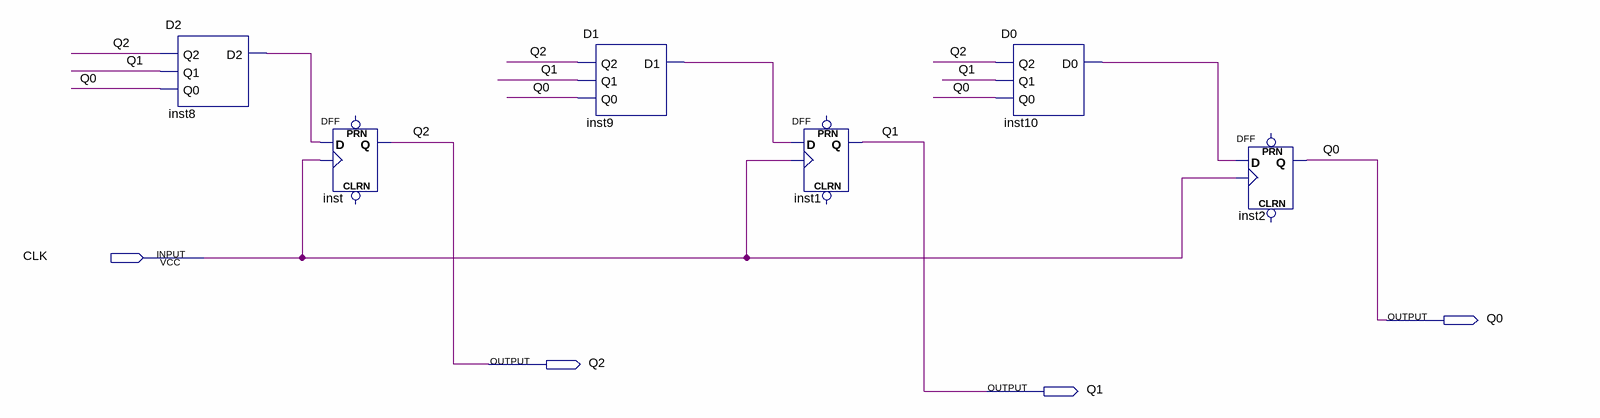
[diagram p0: schematic sheet]
// Quartus schematic DFF_count.bdf as structural Verilog: 6 symbols, 4 pins
module DFF_count (
  input  CLK,
  output Q0,
  output Q2,
  output Q1
);

  wire inst8_d2, inst9_d1, inst10_d0;

  D2 inst8 (.Q2(Q2), .Q1(Q1), .Q0(Q0), .D2(inst8_d2));
  DFF inst (.CLK(CLK), .D(inst8_d2), .Q(Q2));  // open: CLRN, PRN
  D1 inst9 (.Q2(Q2), .Q1(Q1), .Q0(Q0), .D1(inst9_d1));
  DFF inst1 (.CLK(CLK), .D(inst9_d1), .Q(Q1));  // open: CLRN, PRN
  D0 inst10 (.Q2(Q2), .Q1(Q1), .Q0(Q0), .D0(inst10_d0));
  DFF inst2 (.CLK(CLK), .D(inst10_d0), .Q(Q0));  // open: CLRN, PRN
endmodule
